# Altium schematic sheet TWIST_SWITCHv1.1.SchDoc: Top Level
size A3; CompanyName: NOT USED; SheetNumber: 1; SheetTotal: 1; PageSetup: Record=PageOptions|CenterHorizontal=True|CenterVertical=True|PrintScale=1.00|XCorrection=1.00|YCorrection=1.00|PrintKind=0|BorderSize=5000000|LeftOffset=0|BottomOffset=0|Orientation=2|PaperLength=1000|PaperWidth=1000|Scale=100|PaperSource=7|PrintQuality=-4|MediaType=1|DitherType=10|PaperKind=A3|PrintScaleMode=0
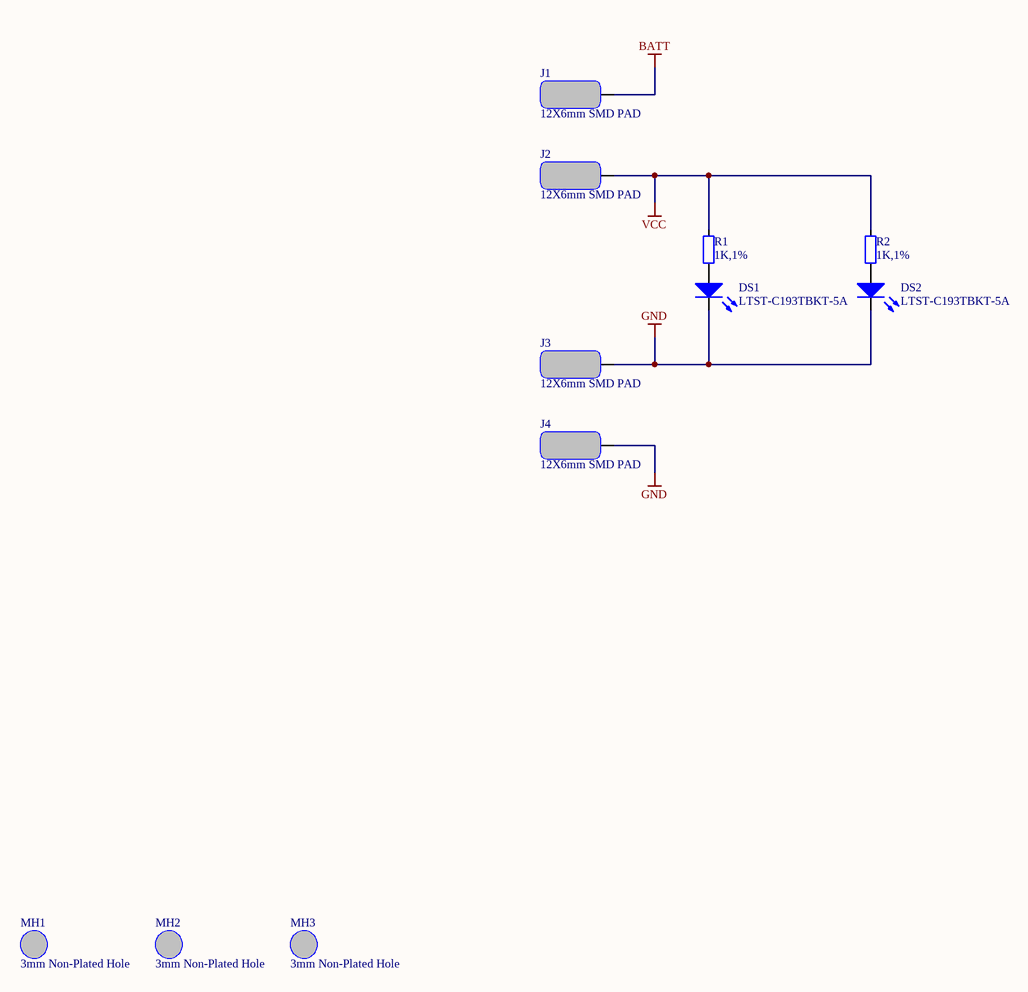
[diagram p0: TWIST_SWITCHv1.1.SchDoc]

## Parts
DS1  LTST-C193TBKT-5A  [LED_SML-LX0603]
DS2  LTST-C193TBKT-5A  [LED_SML-LX0603]
J1  12X6mm SMD PAD  [PAD-SM_12x6MM]
J2  12X6mm SMD PAD  [PAD-SM_12x6MM]
J3  12X6mm SMD PAD  [PAD-SM_12x6MM]
J4  12X6mm SMD PAD  [PAD-SM_12x6MM]
MH1  3mm Non-Plated Hole  [MTG310X600]  (no BOM)
MH2  3mm Non-Plated Hole  [MTG310X600]  (no BOM)
MH3  3mm Non-Plated Hole  [MTG310X600]  (no BOM)
R1  1K,1%  [RESC1005X04N_0402]
R2  1K,1%  [RESC1005X04N_0402]

## Nets
BATT: J1.1
GND: DS1.1(C) DS2.1(C) J3.1 J4.1
VCC: J2.1 R1.1 R2.1
NetDS1_2: DS1.2(A) R1.2
NetDS2_2: DS2.2(A) R2.2

## Notes on the sheet
- Project
- Variant
- Sheet
- Design
- Client
- Revision
- Phone
- Date
- of
- Size
- Time
- A3
- File

## Library data of the parts
DS1 DS2 = LED-10051-A: LED 0603 SM Blue; Manufacturer: Lite-On Inc; Wavelength: 470nm; Axial Intensity: 15mcd; If(max): 5mA; Lens type: Clear; Lens Style/Size: Rectangle with Flat Top, 1.2mm; Vf@I: 2.8V; Viewing Angle: 130; Display_Name: LTST-C193TBKT-5A; BWA PN: LED-10051-A; Colour: Blue; Schematic Symbol: LED_1; Manufacturer Part Number: LTST-C193TBKT-5A; Supplier 1: Digi-Key; Supplier Part Number 1: 160-1827-1-ND
J1-J4 = NONPART-025: Display_Name: 12X6mm SMD PAD; BWA PN: NONPART-025; Schematic Symbol: SMD_PAD
MH1-MH3 = NONPART-005: Display_Name: 3mm Non-Plated Hole; BWA PN: NONPART-005; Schematic Symbol: HOLE_UNPLATED
R1 R2 = RSG-1K000-D: RES 1K 1/16W 1% 0402; Manufacturer: Yageo; Manufacturer Part Number: RC0402FR-071KL; Power: 0.0625W; Display_Name: 1K,1%; Resistance: 1K; Tolerance: 1%; Type: Chip; BWA PN: RSG-1K000-D; Schematic Symbol: RESISTOR_1; Supplier 1: Digi-Key; Supplier Part Number 1: 311-1.00KLRCT-ND